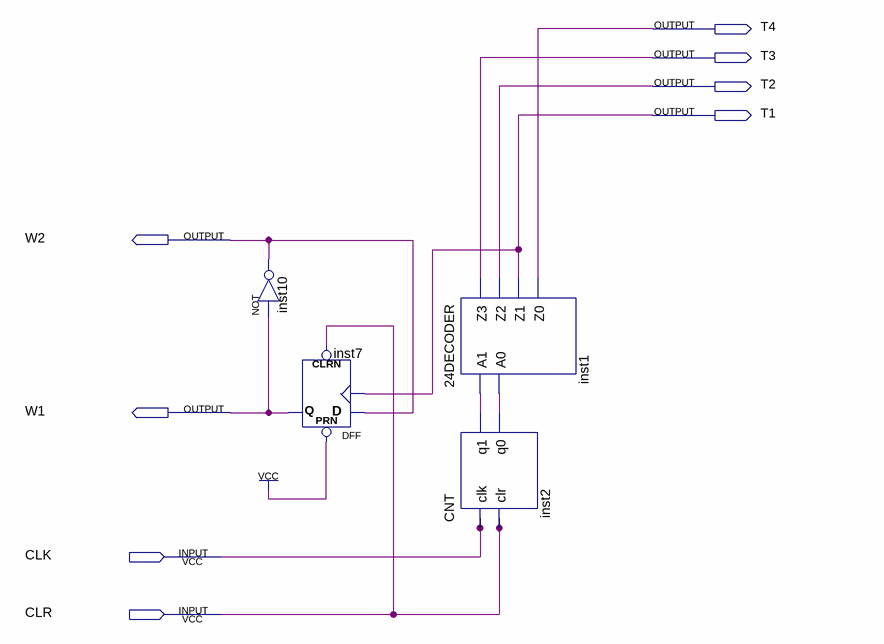
[diagram p0: schematic sheet]
// Quartus schematic SIG.bdf as structural Verilog: 4 symbols, 8 pins
module SIG (
  input  CLK,
  input  CLR,
  output T4,
  output T3,
  output T2,
  output T1,
  output W2,
  output W1
);

  wire inst2_q0, inst2_q1;

  not inst10 (W2, W1);
  DFF inst7 (.CLRN(CLR), .CLK(T1), .D(W2), .PRN(1'b1), .Q(W1));
  \24DECODER  inst1 (.A1(inst2_q1), .A0(inst2_q0), .Z3(T3), .Z2(T2), .Z1(T1), .Z0(T4));
  CNT inst2 (.clk(CLK), .clr(CLR), .q1(inst2_q1), .q0(inst2_q0));
endmodule
